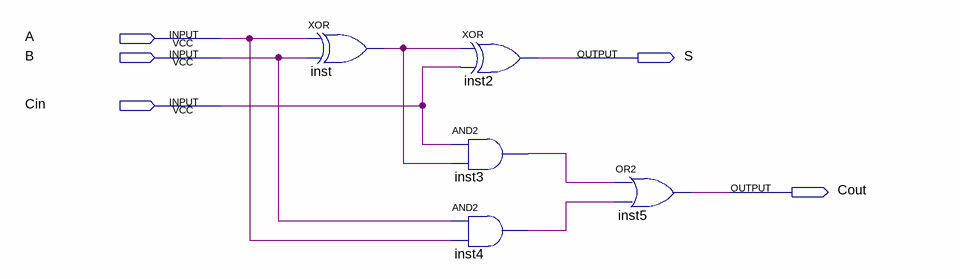
[diagram p0: schematic sheet]
// Quartus schematic fa.bdf as structural Verilog: 5 symbols, 5 pins
module fa (
  input  A,
  input  B,
  input  Cin,
  output S,
  output Cout
);

  wire inst3_out, inst4_out, inst_out;

  xor inst (inst_out, A, B);
  xor inst2 (S, inst_out, Cin);
  and inst3 (inst3_out, Cin, inst_out);
  and inst4 (inst4_out, B, A);
  or inst5 (Cout, inst3_out, inst4_out);
endmodule
